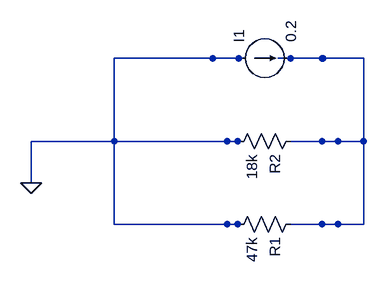
[diagram p0: schematic pannel4.asc]
pannel4.asc, the LTspice schematic file:
Version 4
SHEET 1 880 680
WIRE 464 384 537 384
WIRE 366 384 382 384
SYMBOL res 480 368 R90
SYMATTR InstName R1
SYMATTR Value 47k
WIRE 464 256 537 256
WIRE 366 256 382 256
SYMBOL res 480 240 R90
SYMATTR InstName R2
SYMATTR Value 18k
WIRE 384 128 344 128
WIRE 514 128 444 128
SYMBOL current 384 128 R270
SYMATTR InstName I1
SYMATTR Value 0.2
FLAG 64 320 0
WIRE 576 320 576 384
WIRE 512 384 576 384
WIRE 576 128 576 192
WIRE 512 128 576 128
WIRE 576 192 576 256
WIRE 576 256 576 320
WIRE 512 256 576 256
WIRE 192 256 256 256
WIRE 192 192 192 256
WIRE 192 256 192 320
WIRE 128 256 192 256
WIRE 192 128 256 128
WIRE 192 128 192 192
WIRE 192 384 256 384
WIRE 192 320 192 384
WIRE 64 256 128 256
WIRE 64 256 64 320
WIRE 256 384 320 384
WIRE 256 256 320 256
WIRE 320 256 384 256
WIRE 320 384 384 384
WIRE 320 128 384 128
WIRE 256 128 320 128

The netlist it stands for:
* pannel4.asc
R1 N001 0 47k
R2 N001 0 18k
I1 0 N001 0.2
.backanno
.end